# Altium project CAR_V6_Project.PrjPcb
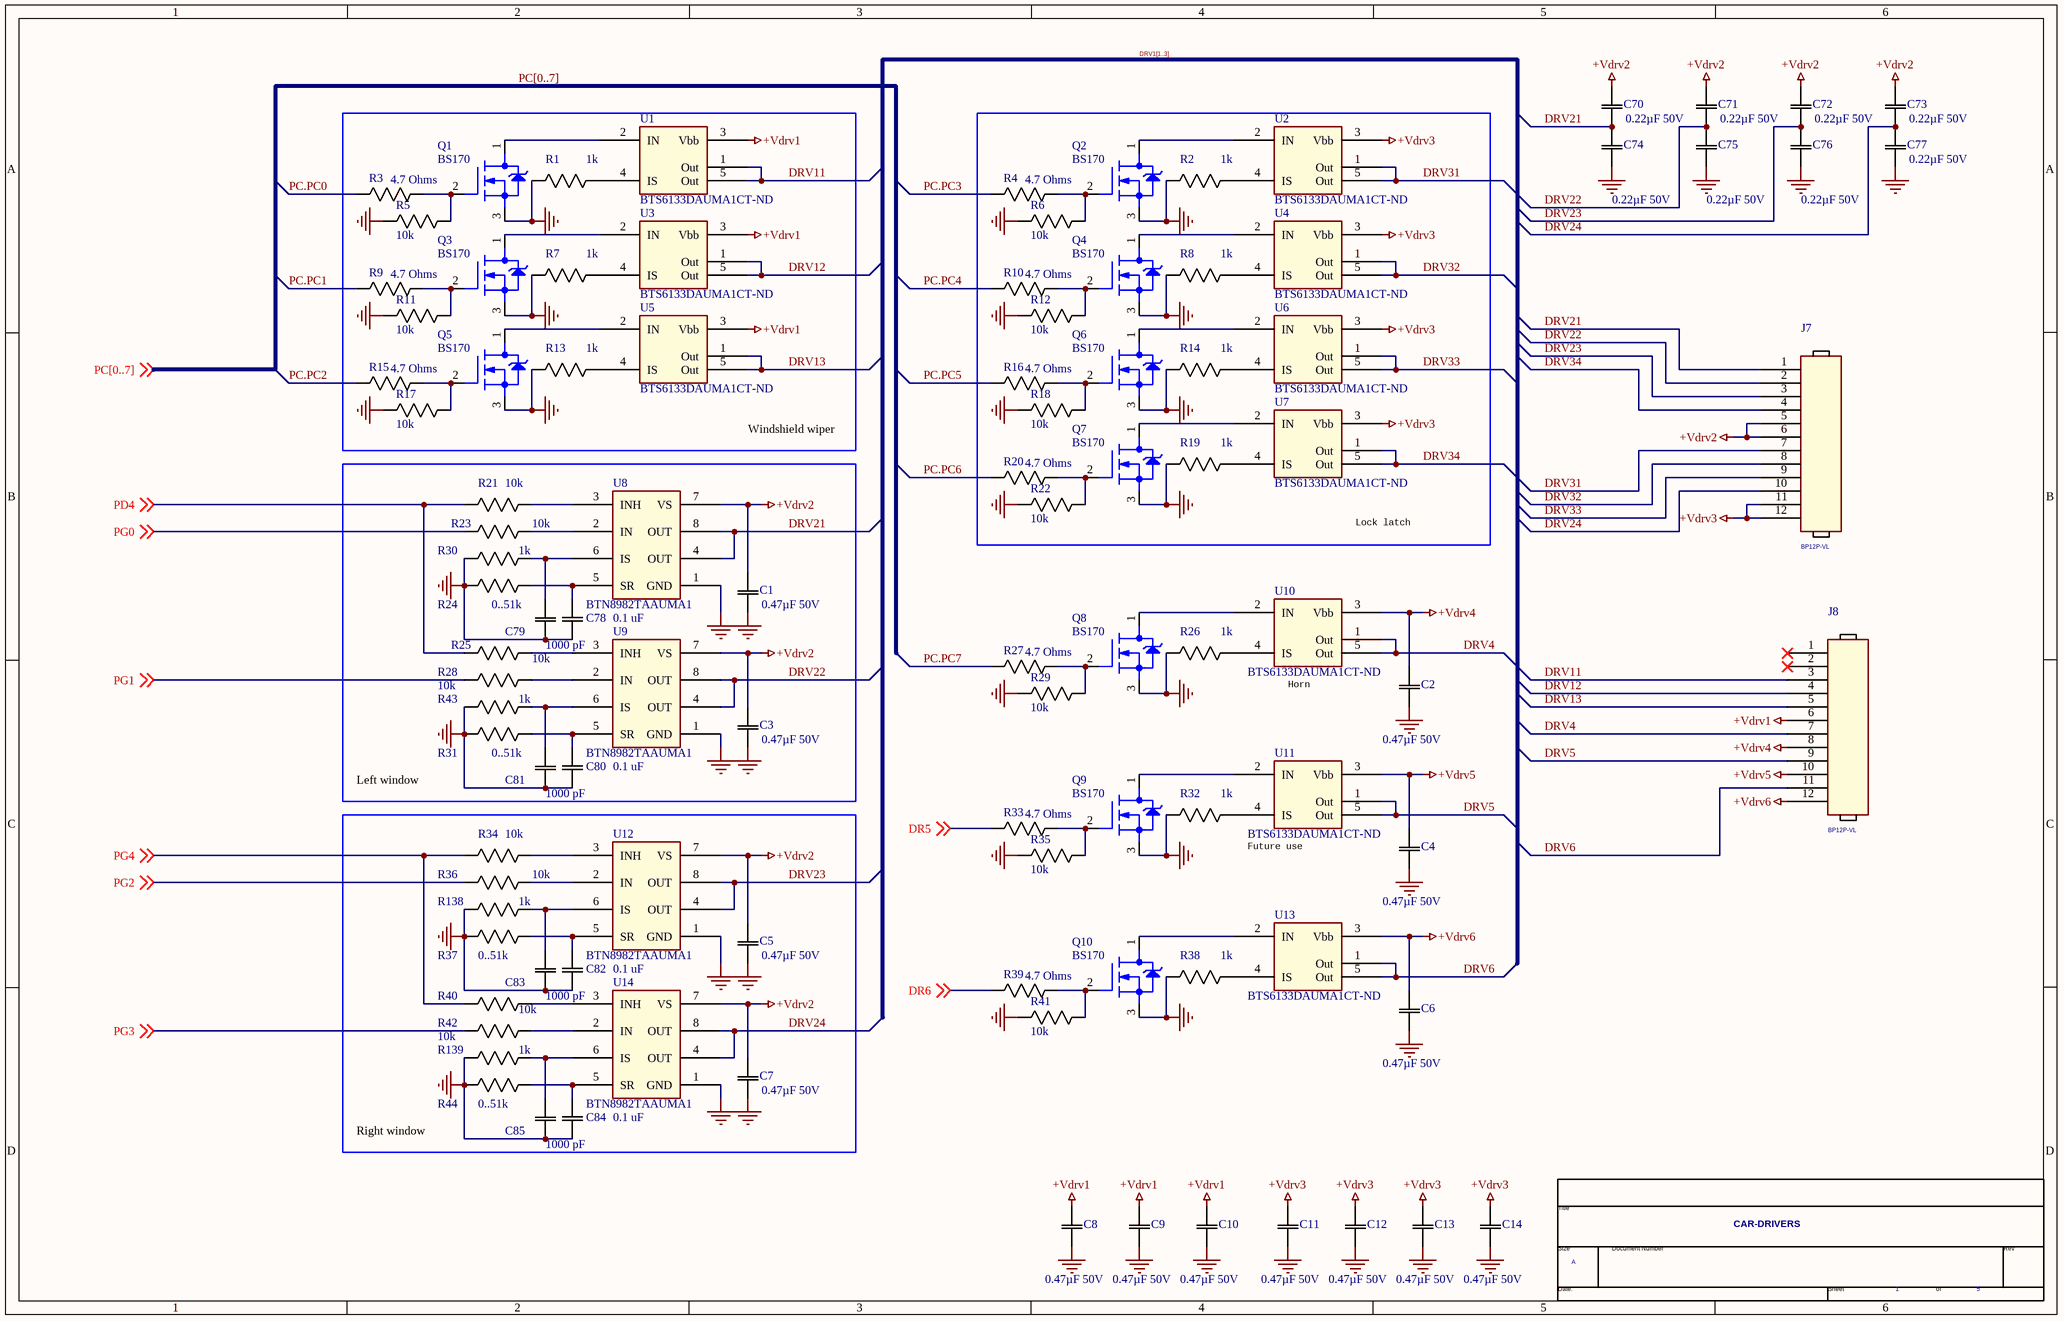
[diagram p0: DRIVERS.SchDoc]
5 sheets, 320 parts. Net scope: global (net labels, ports and power ports of the same name join across sheets).
Board file: CAR.PcbDoc
Sheets:
  DRIVERS.SchDoc
  LIGHT.SchDoc
  MAIN.SchDoc
  POWER.SchDoc
  SENSORS.SchDoc

## Sheet DRIVERS.SchDoc
size 386 x 246 mm

### Parts
(Parts that share a designator on the sheet are numbered #1, #2 ... from top to bottom, then left to right.)
*#1  Page Count: 5  Page Number: 1  Page Size: A  Title: CAR-DRIVERS  (hidden comment: TitleBlock0)  (graphical)
C1  0.47µF 50V  [SR20]
C2  0.47µF 50V  [SR20]
C3  0.47µF 50V  [SR20]
C4  0.47µF 50V  [SR20]
C5  0.47µF 50V  [SR20]
C6  0.47µF 50V  [SR20]
C7  0.47µF 50V  [SR20]
C8  0.47µF 50V  [SR20]
C9  0.47µF 50V  [SR20]
C10  0.47µF 50V  [SR20]
C11  0.47µF 50V  [SR20]
C12  0.47µF 50V  [SR20]
C13  0.47µF 50V  [SR20]
C14  0.47µF 50V  [SR20]
C70  0.22µF 50V  [SR20]
C71  0.22µF 50V  [SR20]
C72  0.22µF 50V  [SR20]
C73  0.22µF 50V  [SR20]
C74  0.22µF 50V  [SR20]
C75  0.22µF 50V  [SR20]
C76  0.22µF 50V  [SR20]
C77  0.22µF 50V  [SR20]
C78  0.1 uF  [SR20]
C79  1000 pF  [SR20]
C80  0.1 uF  [SR20]
C81  1000 pF  [SR20]
C82  0.1 uF  [SR20]
C83  1000 pF  [SR20]
C84  0.1 uF  [SR20]
C85  1000 pF  [SR20]
J7  BP12P-VL  [MOLEX_0874271202]
J8  BP12P-VL  [MOLEX_0874271202]
Q1  BS170  [TO-92]
Q2  BS170  [TO-92]
Q3  BS170  [TO-92]
Q4  BS170  [TO-92]
Q5  BS170  [TO-92]
Q6  BS170  [TO-92]
Q7  BS170  [TO-92]
Q8  BS170  [TO-92]
Q9  BS170  [TO-92]
Q10  BS170  [TO-92]
R1  1k  [RES AXIAL 1/6W]
R2  1k  [RES AXIAL 1/6W]
R3  4.7 Ohms  [RES AXIAL 1/6W]
R4  4.7 Ohms  [RES AXIAL 1/6W]
R5  10k  [RES AXIAL 1/6W]
R6  10k  [RES AXIAL 1/6W]
R7  1k  [RES AXIAL 1/6W]
R8  1k  [RES AXIAL 1/6W]
R9  4.7 Ohms  [RES AXIAL 1/6W]
R10  4.7 Ohms  [RES AXIAL 1/6W]
R11  10k  [RES AXIAL 1/6W]
R12  10k  [RES AXIAL 1/6W]
R13  1k  [RES AXIAL 1/6W]
R14  1k  [RES AXIAL 1/6W]
R15  4.7 Ohms  [RES AXIAL 1/6W]
R16  4.7 Ohms  [RES AXIAL 1/6W]
R17  10k  [RES AXIAL 1/6W]
R18  10k  [RES AXIAL 1/6W]
R19  1k  [RES AXIAL 1/6W]
R20  4.7 Ohms  [RES AXIAL 1/6W]
R21  10k  [RES AXIAL 1/6W]
R22  10k  [RES AXIAL 1/6W]
R23  10k  [RES AXIAL 1/6W]
R24  0..51k  [RES AXIAL 1/6W]
R25  10k  [RES AXIAL 1/6W]
R26  1k  [RES AXIAL 1/6W]
R27  4.7 Ohms  [RES AXIAL 1/6W]
R28  10k  [RES AXIAL 1/6W]
R29  10k  [RES AXIAL 1/6W]
R30  1k  [RES AXIAL 1/6W]
R31  0..51k  [RES AXIAL 1/6W]
R32  1k  [RES AXIAL 1/6W]
R33  4.7 Ohms  [RES AXIAL 1/6W]
R34  10k  [RES AXIAL 1/6W]
R35  10k  [RES AXIAL 1/6W]
R36  10k  [RES AXIAL 1/6W]
R37  0..51k  [RES AXIAL 1/6W]
R38  1k  [RES AXIAL 1/6W]
R39  4.7 Ohms  [RES AXIAL 1/6W]
R40  10k  [RES AXIAL 1/6W]
R41  10k  [RES AXIAL 1/6W]
R42  10k  [RES AXIAL 1/6W]
R43  1k  [RES AXIAL 1/6W]
R44  0..51k  [RES AXIAL 1/6W]
R138  1k  [RES AXIAL 1/6W]
R139  1k  [RES AXIAL 1/6W]
U1  BTS6133DAUMA1CT-ND  [TO114P998X235-6_5N_L]
U2  BTS6133DAUMA1CT-ND  [TO114P998X235-6_5N_L]
U3  BTS6133DAUMA1CT-ND  [TO114P998X235-6_5N_L]
U4  BTS6133DAUMA1CT-ND  [TO114P998X235-6_5N_L]
U5  BTS6133DAUMA1CT-ND  [TO114P998X235-6_5N_L]
U6  BTS6133DAUMA1CT-ND  [TO114P998X235-6_5N_L]
U7  BTS6133DAUMA1CT-ND  [TO114P998X235-6_5N_L]
U8  BTN8982TAAUMA1  [TO263-7]
U9  BTN8982TAAUMA1  [TO263-7]
U10  BTS6133DAUMA1CT-ND  [TO114P998X235-6_5N_L]
U11  BTS6133DAUMA1CT-ND  [TO114P998X235-6_5N_L]
U12  BTN8982TAAUMA1  [TO263-7]
U13  BTS6133DAUMA1CT-ND  [TO114P998X235-6_5N_L]
U14  BTN8982TAAUMA1  [TO263-7]

### Blocks framed on the sheet
Windshield wiper: Q1 Q3 Q5 R1 R3 R5 R7 R9 R11 R13 R15 R17 U1 U3 U5
Lock latch: Q2 Q4 Q6 Q7 R2 R4 R6 R8 R10 R12 R14 R16 R18-R20 R22 U2 U4 U6 U7
Left window: C1 C3 C78-C81 R21 R23-R25 R28 R30 R31 R43 U8 U9
Right window: C5 C7 C82-C85 R34 R36 R37 R40 R42 R44 R138 R139 U12 U14

### Nets
+Vdrv1: C8.2 C9.2 C10.2 J8.6 U1.3(Vbb) U3.3(Vbb) U5.3(Vbb)
+Vdrv2: C1.2 C3.2 C5.2 C7.2 C70.2 C71.2 C72.2 C73.2 J7.5 J7.6 U8.7(VS) U9.7(VS) U12.7(VS) U14.7(VS)
+Vdrv3: C11.2 C12.2 C13.2 C14.2 J7.11 J7.12 U2.3(Vbb) U4.3(Vbb) U6.3(Vbb) U7.3(Vbb)
+Vdrv4: C2.2 J8.8 U10.3(Vbb)
+Vdrv5: C4.2 J8.10 U11.3(Vbb)
+Vdrv6: C6.2 J8.12 U13.3(Vbb)
GND: C1.1 C2.1 C3.1 C4.1 C5.1 C6.1 C7.1 C8.1 C9.1 C10.1 C11.1 C12.1 C13.1 C14.1 C74.1 C75.1 C76.1 C77.1 C78.2 C79.1 C80.2 C81.1 C82.2 C83.1 C84.2 C85.1 Q1.3(S) Q2.3(S) Q3.3(S) Q4.3(S) Q5.3(S) Q6.3(S) Q7.3(S) Q8.3(S) Q9.3(S) Q10.3(S) R1.2 R2.2 R5.1 R6.1 R7.2 R8.2 R11.1 R12.1 R13.2 R14.2 R17.1 R18.1 R19.2 R22.1 R24.1 R26.2 R29.1 R30.2 R31.1 R32.2 R35.1 R37.1 R38.2 R41.1 R43.2 R44.1 R138.2 R139.2 U8.1(GND) U9.1(GND) U12.1(GND) U14.1(GND)
DR5: R33.2 ; off-sheet DR5
DR6: R39.2 ; off-sheet DR6
DRV4: J8.7 U10.1(Out) U10.5(Out)
DRV5: J8.9 U11.1(Out) U11.5(Out)
DRV6: J8.11 U13.1(Out) U13.5(Out)
DRV11: J8.3 U1.1(Out) U1.5(Out)
DRV12: J8.4 U3.1(Out) U3.5(Out)
DRV13: J8.5 U5.1(Out) U5.5(Out)
DRV21: C70.1 C74.2 J7.1 U8.4(OUT) U8.8(OUT)
DRV22: C71.1 C75.2 J7.2 U9.4(OUT) U9.8(OUT)
DRV23: C72.1 C76.2 J7.3 U12.4(OUT) U12.8(OUT)
DRV24: C73.1 C77.2 J7.10 U14.4(OUT) U14.8(OUT)
DRV31: J7.7 U2.1(Out) U2.5(Out)
DRV32: J7.8 U4.1(Out) U4.5(Out)
DRV33: J7.9 U6.1(Out) U6.5(Out)
DRV34: J7.4 U7.1(Out) U7.5(Out)
PC.PC0: R3.2
PC.PC1: R9.2
PC.PC2: R15.2
PC.PC3: R4.2
PC.PC4: R10.2
PC.PC5: R16.2
PC.PC6: R20.2
PC.PC7: R27.2
PD4: R21.1 R25.1 ; off-sheet PD4
PG0: R23.1 ; off-sheet PG0
PG1: R28.1 ; off-sheet PG1
PG2: R36.1 ; off-sheet PG2
PG3: R42.1 ; off-sheet PG3
PG4: R34.1 R40.1 ; off-sheet PG4
NetC78_1: C78.1 R24.2 U8.5(SR)
NetC79_2: C79.2 R30.1 U8.6(IS)
NetC80_1: C80.1 R31.2 U9.5(SR)
NetC81_2: C81.2 R43.1 U9.6(IS)
NetC82_1: C82.1 R37.2 U12.5(SR)
NetC83_2: C83.2 R138.1 U12.6(IS)
NetC84_1: C84.1 R44.2 U14.5(SR)
NetC85_2: C85.2 R139.1 U14.6(IS)
NetQ1_1: Q1.1(D) U1.2(IN)
NetQ1_2: Q1.2(G) R3.1 R5.2
NetQ2_1: Q2.1(D) U2.2(IN)
NetQ2_2: Q2.2(G) R4.1 R6.2
NetQ3_1: Q3.1(D) U3.2(IN)
NetQ3_2: Q3.2(G) R9.1 R11.2
NetQ4_1: Q4.1(D) U4.2(IN)
NetQ4_2: Q4.2(G) R10.1 R12.2
NetQ5_1: Q5.1(D) U5.2(IN)
NetQ5_2: Q5.2(G) R15.1 R17.2
NetQ6_1: Q6.1(D) U6.2(IN)
NetQ6_2: Q6.2(G) R16.1 R18.2
NetQ7_1: Q7.1(D) U7.2(IN)
NetQ7_2: Q7.2(G) R20.1 R22.2
NetQ8_1: Q8.1(D) U10.2(IN)
NetQ8_2: Q8.2(G) R27.1 R29.2
NetQ9_1: Q9.1(D) U11.2(IN)
NetQ9_2: Q9.2(G) R33.1 R35.2
NetQ10_1: Q10.1(D) U13.2(IN)
NetQ10_2: Q10.2(G) R39.1 R41.2
NetR1_1: R1.1 U1.4(IS)
NetR2_1: R2.1 U2.4(IS)
NetR7_1: R7.1 U3.4(IS)
NetR8_1: R8.1 U4.4(IS)
NetR13_1: R13.1 U5.4(IS)
NetR14_1: R14.1 U6.4(IS)
NetR19_1: R19.1 U7.4(IS)
NetR21_2: R21.2 U8.3(INH)
NetR23_2: R23.2 U8.2(IN)
NetR25_2: R25.2 U9.3(INH)
NetR26_1: R26.1 U10.4(IS)
NetR28_2: R28.2 U9.2(IN)
NetR32_1: R32.1 U11.4(IS)
NetR34_2: R34.2 U12.3(INH)
NetR36_2: R36.2 U12.2(IN)
NetR38_1: R38.1 U13.4(IS)
NetR40_2: R40.2 U14.3(INH)
NetR42_2: R42.2 U14.2(IN)

Not connected (* = marked no-connect by the designer): J8 1* 2*

### Buses and harness runs
bus DRV1[1..3]
bus PC[0..7]

### Notes on the sheet
- (near U10) Horn
- Future use
- (in symbol TitleBlock0) Title; Size; Document Number; Rev; Date:; Sheet; of

### Library data of the parts
C1-C14 = CAP RADIAL 2.54: CAP CER 0.47UF 50V X7R RADIAL; Manufacturer_Part_Number: C315C474K5R5TA7303; Vendor: KEMET; Type: DEV; RefDes: RefDes; Value: 0.47µF 50V
C70-C77 = CAP RADIAL 2.54: CAP CER 0.22UF 50V X7R RADIAL; Manufacturer_Part_Number: C320C224K5R5TA; Vendor: KEMET; Type: DEV; RefDes: RefDes; Value: 0.22µF 50V
C78 C80 C82 C84 = CAP RADIAL 2.54: 0.1µF ±10% 100V Ceramic Capacitor X7R Radial; Manufacturer_Part_Number: C320C104K1R5TA7301; Vendor: KEMET; Type: DEV; RefDes: RefDes; Value: 0.1 uF
C79 C81 C83 C85 = CAP RADIAL 2.54: CAP CER 1000PF 50V X7R RADIAL; Manufacturer_Part_Number: C315C102K5R5TA7301; Vendor: KEMET; Type: DEV; RefDes: RefDes; Value: 1000 pF
J7 J8 = HEADER 12
Q1-Q10 = BS170: MOSFET N-CH 60V 500MA TO-92; Manufacturer_Part_Number: ON Semiconductor; Value: BS170
R1 R2 R7 R8 R13 R14 R19 R26 R30 R32 R38 R43 R138 R139 = Resistor Axial  1/6W: RES 1K OHM 1/6W 5% AXIAL; Manufacturer_Part_Number: CFR-12JB-52-1K; Vendor: Yageo; RefDes: RefDes; Type: DEV; Value: 1k
R3 R4 R9 R10 R15 R16 R20 R27 R33 R39 = Resistor Axial  1/6W: RES 4.7 OHM 1/6W 5% AXIAL; Manufacturer_Part_Number: CFR-12JB-52-4R7; Vendor: Yageo; RefDes: RefDes; Type: DEV; Value: 4.7 Ohms
R5 R6 R11 R12 R17 R18 R21-R23 R25 R28 R29 R34-R36 R40-R42 = Resistor Axial  1/6W: RES 10K OHM 1/6W 5% AXIAL; Manufacturer_Part_Number: CFR-12JB-52-10K; Vendor: Yageo; RefDes: RefDes; Type: DEV; Value: 10k
R24 R31 R37 R44 = Resistor Axial  1/6W: RES 1/6W AXIAL; Vendor: Yageo; RefDes: RefDes; Type: DEV; Value: 0..51k
  R31 R44: Manufacturer_Part_Number: *
U8 U9 U12 U14 = BTN7971B
*#1 = TitleBlock0: Page Create Date: March  8, 1995

## Sheet LIGHT.SchDoc
size 246 x 182 mm
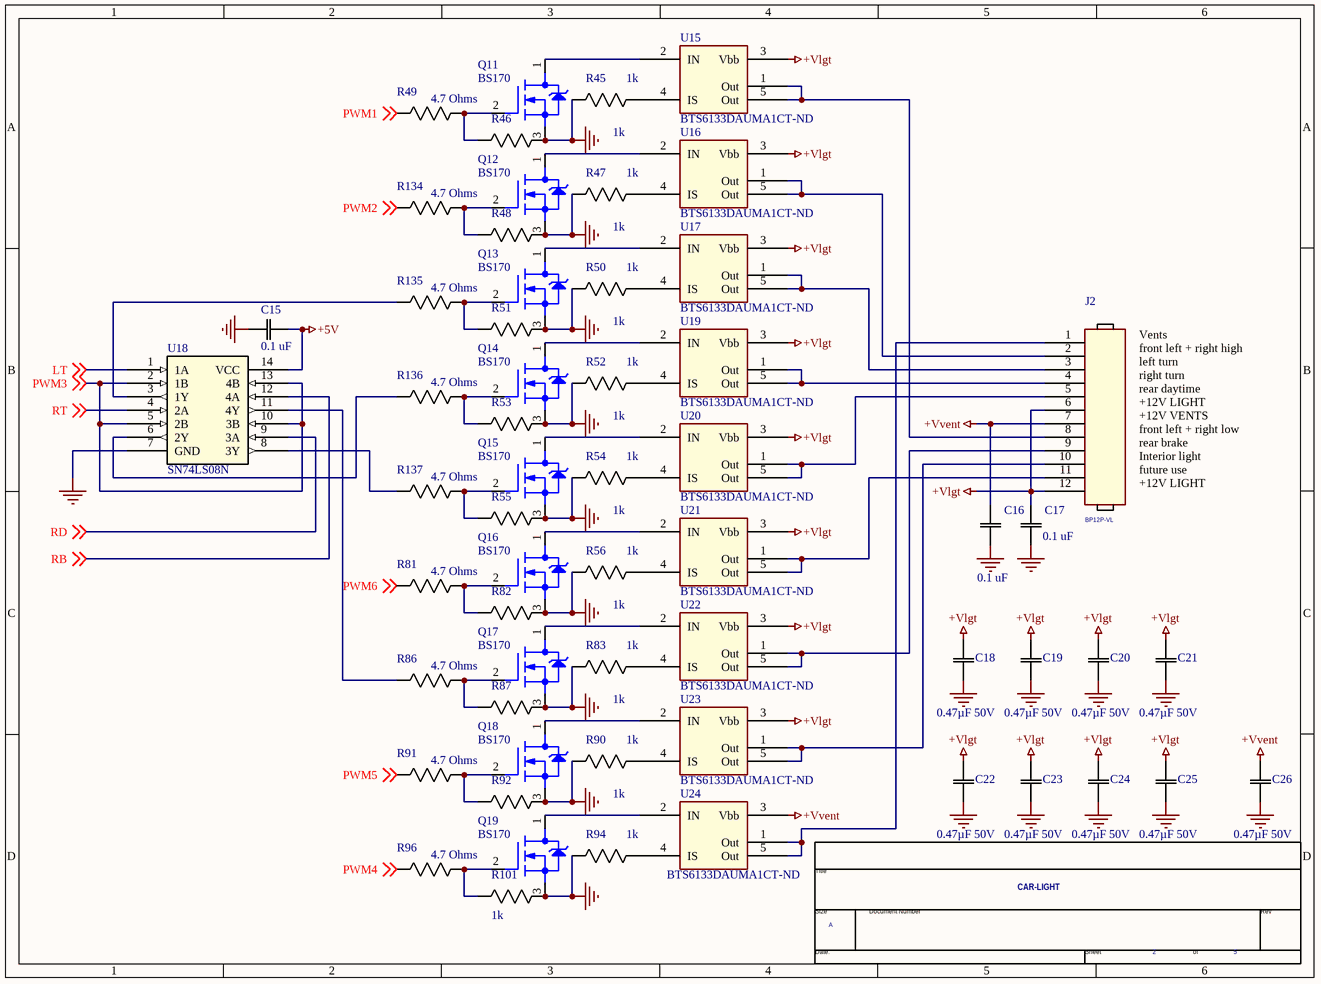
[diagram p1: LIGHT.SchDoc]

### Parts
(Parts that share a designator on the sheet are numbered #1, #2 ... from top to bottom, then left to right.)
*#2  Page Count: 5  Page Number: 2  Page Size: A  Title: CAR-LIGHT  (hidden comment: TitleBlock0)  (graphical)
C15  0.1 uF  [SR20]
C16  0.1 uF  [SR20]
C17  0.1 uF  [SR20]
C18  0.47µF 50V  [SR20]
C19  0.47µF 50V  [SR20]
C20  0.47µF 50V  [SR20]
C21  0.47µF 50V  [SR20]
C22  0.47µF 50V  [SR20]
C23  0.47µF 50V  [SR20]
C24  0.47µF 50V  [SR20]
C25  0.47µF 50V  [SR20]
C26  0.47µF 50V  [SR20]
J2  BP12P-VL  [MOLEX_0874271202]
Q11  BS170  [TO-92]
Q12  BS170  [TO-92]
Q13  BS170  [TO-92]
Q14  BS170  [TO-92]
Q15  BS170  [TO-92]
Q16  BS170  [TO-92]
Q17  BS170  [TO-92]
Q18  BS170  [TO-92]
Q19  BS170  [TO-92]
R45  1k  [RES AXIAL 1/6W]
R46  1k  [RES AXIAL 1/6W]
R47  1k  [RES AXIAL 1/6W]
R48  1k  [RES AXIAL 1/6W]
R49  4.7 Ohms  [RES AXIAL 1/6W]
R50  1k  [RES AXIAL 1/6W]
R51  1k  [RES AXIAL 1/6W]
R52  1k  [RES AXIAL 1/6W]
R53  1k  [RES AXIAL 1/6W]
R54  1k  [RES AXIAL 1/6W]
R55  1k  [RES AXIAL 1/6W]
R56  1k  [RES AXIAL 1/6W]
R81  4.7 Ohms  [RES AXIAL 1/6W]
R82  1k  [RES AXIAL 1/6W]
R83  1k  [RES AXIAL 1/6W]
R86  4.7 Ohms  [RES AXIAL 1/6W]
R87  1k  [RES AXIAL 1/6W]
R90  1k  [RES AXIAL 1/6W]
R91  4.7 Ohms  [RES AXIAL 1/6W]
R92  1k  [RES AXIAL 1/6W]
R94  1k  [RES AXIAL 1/6W]
R96  4.7 Ohms  [RES AXIAL 1/6W]
R101  1k  [RES AXIAL 1/6W]
R134  4.7 Ohms  [RES AXIAL 1/6W]
R135  4.7 Ohms  [RES AXIAL 1/6W]
R136  4.7 Ohms  [RES AXIAL 1/6W]
R137  4.7 Ohms  [RES AXIAL 1/6W]
U15  BTS6133DAUMA1CT-ND  [TO114P998X235-6_5N_L]
U16  BTS6133DAUMA1CT-ND  [TO114P998X235-6_5N_L]
U17  BTS6133DAUMA1CT-ND  [TO114P998X235-6_5N_L]
U18  SN74LS08N  [PDIP14_300MC]
U19  BTS6133DAUMA1CT-ND  [TO114P998X235-6_5N_L]
U20  BTS6133DAUMA1CT-ND  [TO114P998X235-6_5N_L]
U21  BTS6133DAUMA1CT-ND  [TO114P998X235-6_5N_L]
U22  BTS6133DAUMA1CT-ND  [TO114P998X235-6_5N_L]
U23  BTS6133DAUMA1CT-ND  [TO114P998X235-6_5N_L]
U24  BTS6133DAUMA1CT-ND  [TO114P998X235-6_5N_L]

### Nets
+5V: C15.1 U18.14(VCC)
+Vlgt: C17.2 C18.2 C19.2 C20.2 C21.2 C22.2 C23.2 C24.2 C25.2 J2.6 J2.12 U15.3(Vbb) U16.3(Vbb) U17.3(Vbb) U19.3(Vbb) U20.3(Vbb) U21.3(Vbb) U22.3(Vbb) U23.3(Vbb)
+Vvent: C16.2 C26.2 J2.7 U24.3(Vbb)
GND: C15.2 C16.1 C17.1 C18.1 C19.1 C20.1 C21.1 C22.1 C23.1 C24.1 C25.1 C26.1 Q11.3(S) Q12.3(S) Q13.3(S) Q14.3(S) Q15.3(S) Q16.3(S) Q17.3(S) Q18.3(S) Q19.3(S) R45.2 R46.1 R47.2 R48.1 R50.2 R51.1 R52.2 R53.1 R54.2 R55.1 R56.2 R82.1 R83.2 R87.1 R90.2 R92.1 R94.2 R101.1 U18.7(GND)
LT: U18.1(1A) ; off-sheet LT
PWM1: R49.2 ; off-sheet PWM1
PWM2: R134.2 ; off-sheet PWM2
PWM3: U18.2(1B) U18.5(2B) U18.10(3B) U18.13(4B) ; off-sheet PWM3
PWM4: R96.2 ; off-sheet PWM4
PWM5: R91.2 ; off-sheet PWM5
PWM6: R81.2 ; off-sheet PWM6
RB: U18.12(4A) ; off-sheet RB
RD: U18.9(3A) ; off-sheet RD
RT: U18.4(2A) ; off-sheet RT
NetJ2_1: J2.1 U24.1(Out) U24.5(Out)
NetJ2_2: J2.2 U16.1(Out) U16.5(Out)
NetJ2_3: J2.3 U17.1(Out) U17.5(Out)
NetJ2_4: J2.4 U19.1(Out) U19.5(Out)
NetJ2_5: J2.5 U20.1(Out) U20.5(Out)
NetJ2_8: J2.8 U15.1(Out) U15.5(Out)
NetJ2_9: J2.9 U22.1(Out) U22.5(Out)
NetJ2_10: J2.10 U23.1(Out) U23.5(Out)
NetJ2_11: J2.11 U21.1(Out) U21.5(Out)
NetQ11_1: Q11.1(D) U15.2(IN)
NetQ11_2: Q11.2(G) R46.2 R49.1
NetQ12_1: Q12.1(D) U16.2(IN)
NetQ12_2: Q12.2(G) R48.2 R134.1
NetQ13_1: Q13.1(D) U17.2(IN)
NetQ13_2: Q13.2(G) R51.2 R135.1
NetQ14_1: Q14.1(D) U19.2(IN)
NetQ14_2: Q14.2(G) R53.2 R136.1
NetQ15_1: Q15.1(D) U20.2(IN)
NetQ15_2: Q15.2(G) R55.2 R137.1
NetQ16_1: Q16.1(D) U21.2(IN)
NetQ16_2: Q16.2(G) R81.1 R82.2
NetQ17_1: Q17.1(D) U22.2(IN)
NetQ17_2: Q17.2(G) R86.1 R87.2
NetQ18_1: Q18.1(D) U23.2(IN)
NetQ18_2: Q18.2(G) R91.1 R92.2
NetQ19_1: Q19.1(D) U24.2(IN)
NetQ19_2: Q19.2(G) R96.1 R101.2
NetR45_1: R45.1 U15.4(IS)
NetR47_1: R47.1 U16.4(IS)
NetR50_1: R50.1 U17.4(IS)
NetR52_1: R52.1 U19.4(IS)
NetR54_1: R54.1 U20.4(IS)
NetR56_1: R56.1 U21.4(IS)
NetR83_1: R83.1 U22.4(IS)
NetR86_2: R86.2 U18.11(4Y)
NetR90_1: R90.1 U23.4(IS)
NetR94_1: R94.1 U24.4(IS)
NetR135_2: R135.2 U18.3(1Y)
NetR136_2: R136.2 U18.6(2Y)
NetR137_2: R137.2 U18.8(3Y)

### Notes on the sheet
- front left + right high
- left turn
- right turn
- rear daytime
- Vents
- front left + right low
- rear brake
- Interior light
- +12V VENTS
- +12V LIGHT
- future use
- (in symbol TitleBlock0) Title; Size; Document Number; Rev; Date:; Sheet; of

### Library data of the parts
C15-C17 = CAP RADIAL 2.54: as C78 on sheet DRIVERS; RefDes: RefDes; Value: 0.1 uF
C18-C26 = CAP RADIAL 2.54: as C1 on sheet DRIVERS; RefDes: RefDes; Value: 0.47µF 50V
J2 = HEADER 12
Q11-Q19 = BS170: as Q1 on sheet DRIVERS; Value: BS170
R45-R48 R50-R56 R82 R83 R87 R90 R92 R94 R101 = Resistor Axial  1/6W: as R1 on sheet DRIVERS; RefDes: RefDes; Type: DEV; Value: 1k
R49 R81 R86 R91 R96 R134-R137 = Resistor Axial  1/6W: as R3 on sheet DRIVERS; RefDes: RefDes; Type: DEV; Value: 4.7 Ohms
U18 = SN74LS08N: IC GATE AND 4CH 2-INP 14DIP; Vendor: Texas Instruments; Built_By: EMA_UL_Team; C: Copyright (C) 2015 Accelerated Designs. All rights reserved; Manufacturer_Part_Number: SN74LS08N; RefDes: RefDes; Type: DEV; Value: SN74LS08N
*#2 = TitleBlock0: Page Create Date: March  8, 1995

## Sheet MAIN.SchDoc
size 386 x 246 mm
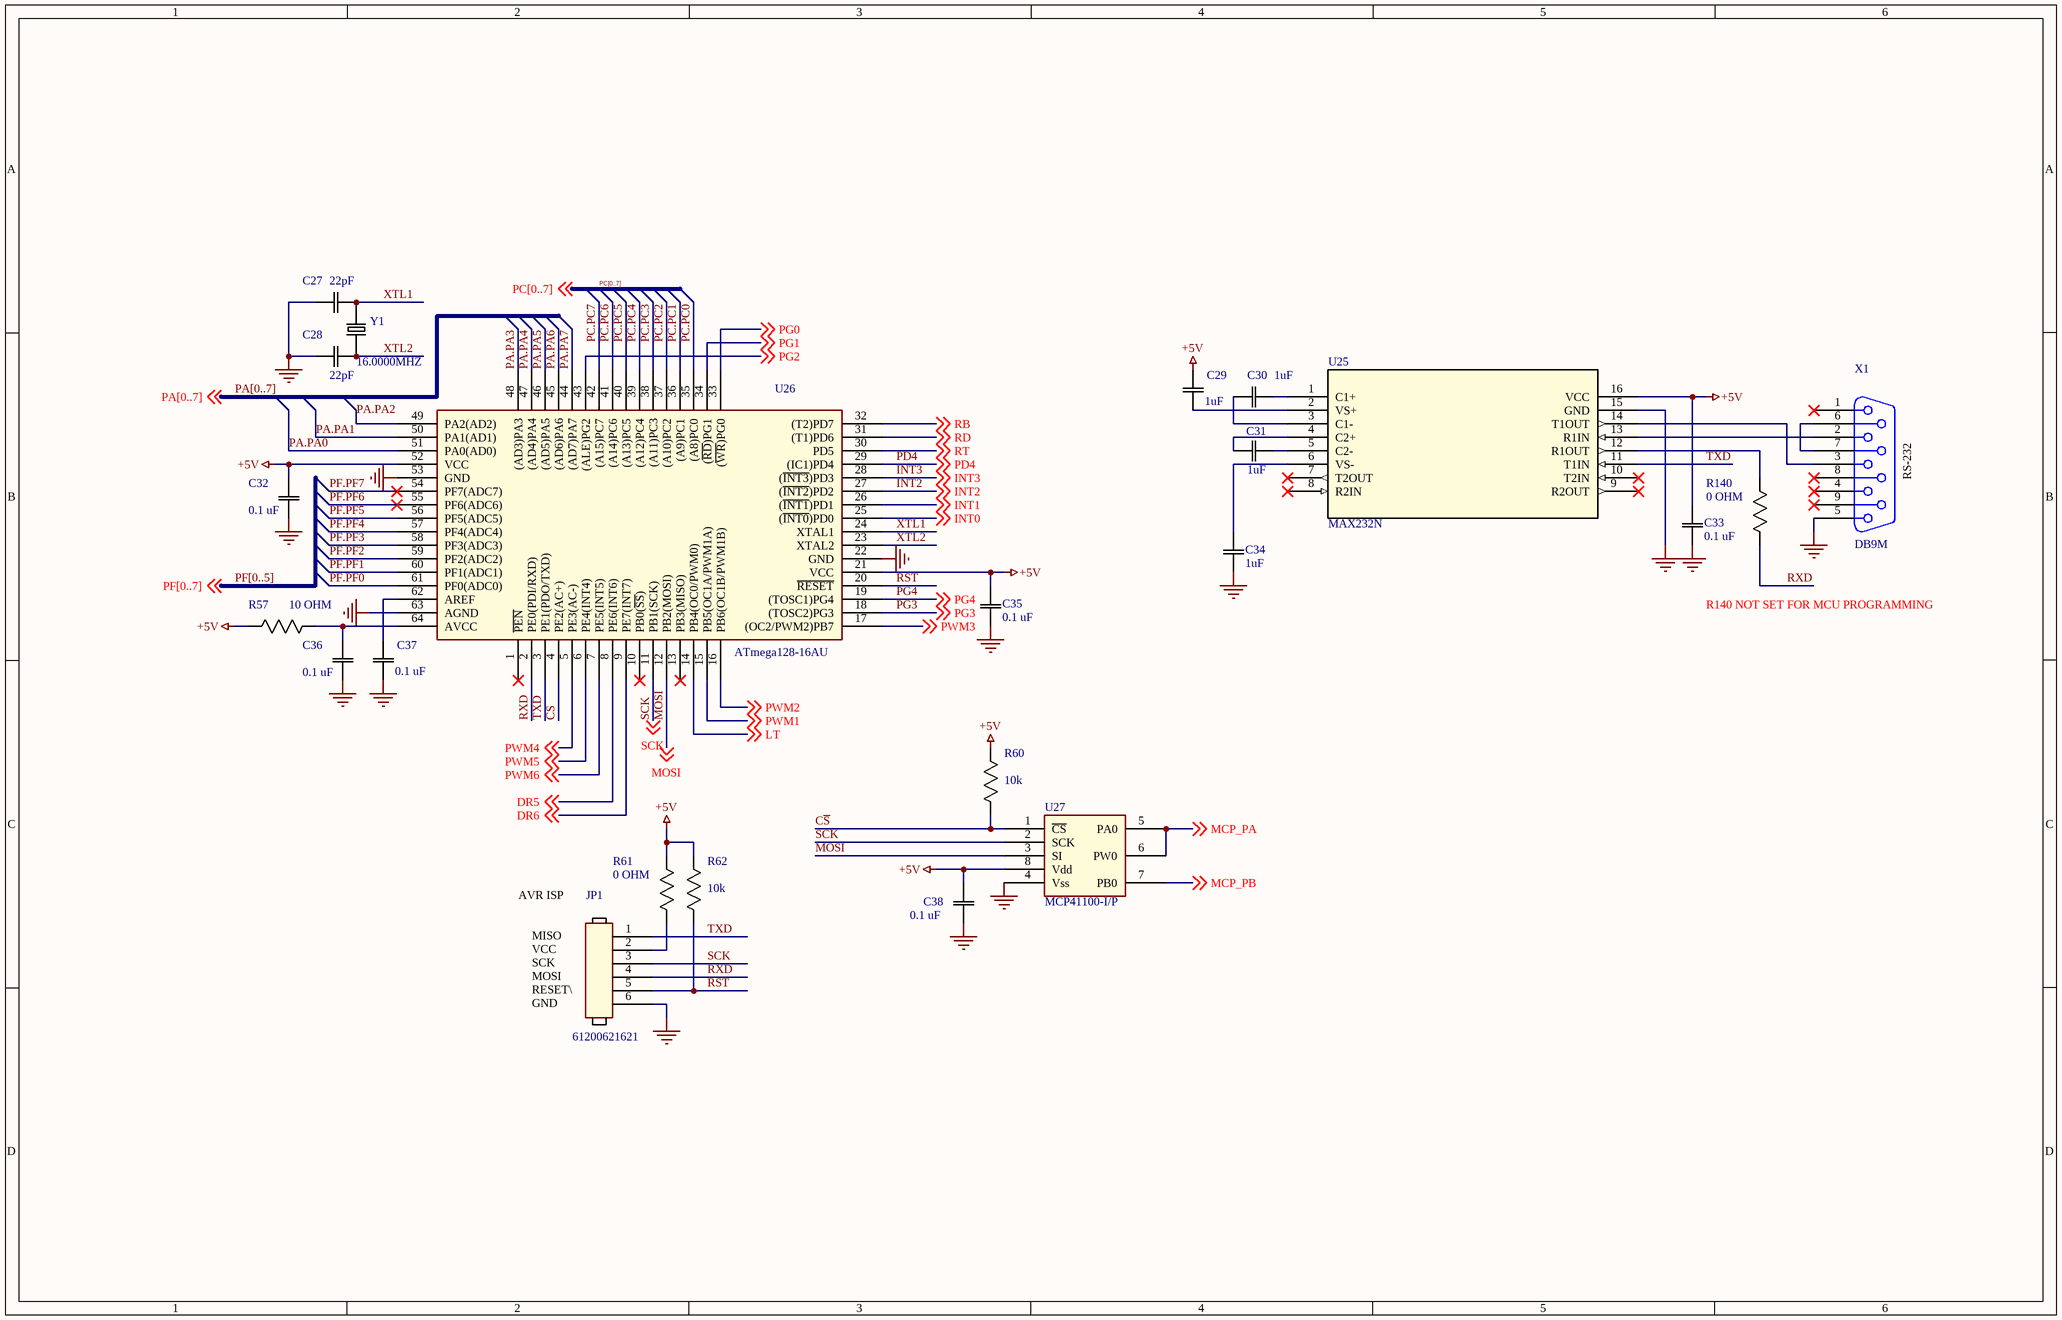
[diagram p2: MAIN.SchDoc]

### Parts
C27  22pF  [SR20]
C28  22pF  [SR20]
C29  1uF  [SR20]
C30  1uF  [SR20]
C31  1uF  [SR20]
C32  0.1 uF  [SR20]
C33  0.1 uF  [SR20]
C34  1uF  [SR20]
C35  0.1 uF  [SR20]
C36  0.1 uF  [SR20]
C37  0.1 uF  [SR20]
C38  0.1 uF  [SR20]
JP1  61200621621  [BLKCON.100/VH/TM2OE/W.200/6]
R57  10 OHM  [RES AXIAL 1/6W]
R60  10k  [RES AXIAL 1/6W]
R61  0 OHM  [RES AXIAL 1/6W]
R62  10k  [RES AXIAL 1/6W]
R140  0 OHM  [RES AXIAL 1/6W]
U25  MAX232N  [N16]
U26  ATmega128-16AU  [QUAD.80M/64/WG16.00]
U27  MCP41100-I/P  [*DIP254P762X508-8]
X1  DB9M  [DSUB/RP.318/TM/9]
Y1  16.0000MHZ  [HC-49/US]

### Nets
+5V: C29.1 C32.2 C33.2 C35.2 C38.2 R57.2 R60.2 R61.2 R62.2 U25.16(VCC) U26.21(VCC) U26.52(VCC) U27.8(Vdd)
GND: C27.1 C28.1 C32.1 C33.1 C34.2 C35.1 C36.1 C37.1 C38.1 JP1.6 U25.15(GND) U26.22(GND) U26.53(GND) U26.63(AGND) U27.4(Vss) X1.5
C~{S}: R60.1 U26.4(PE2(AC+)) U27.1(~{CS})
DR5: U26.8(PE6(INT6)) ; off-sheet DR5
DR6: U26.9(PE7(INT7)) ; off-sheet DR6
INT0: U26.25((~{INT0})PD0) ; off-sheet INT0
INT1: U26.26((~{INT1})PD1) ; off-sheet INT1
INT2: U26.27((~{INT2})PD2) ; off-sheet INT2
INT3: U26.28((~{INT3})PD3) ; off-sheet INT3
LT: U26.14(PB4(OC0/PWM0)) ; off-sheet LT
MCP_PA: U27.5(PA0) U27.6(PW0) ; off-sheet MCP_PA
MCP_PB: U27.7(PB0) ; off-sheet MCP_PB
MOSI: U26.12(PB2(MOSI)) U27.3(SI) ; off-sheet MOSI
PA.PA0: U26.51(PA0(AD0))
PA.PA1: U26.50(PA1(AD1))
PA.PA2: U26.49(PA2(AD2))
PA.PA3: U26.48((AD3)PA3)
PA.PA4: U26.47((AD4)PA4)
PA.PA5: U26.46((AD5)PA5)
PA.PA6: U26.45((AD6)PA6)
PA.PA7: U26.44((AD7)PA7)
PC.PC0: U26.35((A8)PC0)
PC.PC1: U26.36((A9)PC1)
PC.PC2: U26.37((A10)PC2)
PC.PC3: U26.38((A11)PC3)
PC.PC4: U26.39((A12)PC4)
PC.PC5: U26.40((A13)PC5)
PC.PC6: U26.41((A14)PC6)
PC.PC7: U26.42((A15)PC7)
PD4: U26.29((IC1)PD4) ; off-sheet PD4
PF.PF0: U26.61(PF0(ADC0))
PF.PF1: U26.60(PF1(ADC1))
PF.PF2: U26.59(PF2(ADC2))
PF.PF3: U26.58(PF3(ADC3))
PF.PF4: U26.57(PF4(ADC4))
PF.PF5: U26.56(PF5(ADC5))
PF.PF6: U26.55(PF6(ADC6))
PF.PF7: U26.54(PF7(ADC7))
PG0: U26.33((~{WR})PG0) ; off-sheet PG0
PG1: U26.34((~{RD})PG1) ; off-sheet PG1
PG2: U26.43((ALE)PG2) ; off-sheet PG2
PG3: U26.18((TOSC2)PG3) ; off-sheet PG3
PG4: U26.19((TOSC1)PG4) ; off-sheet PG4
PWM1: U26.15(PB5(OC1A/PWM1A)) ; off-sheet PWM1
PWM2: U26.16(PB6(OC1B/PWM1B)) ; off-sheet PWM2
PWM3: U26.17((OC2/PWM2)PB7) ; off-sheet PWM3
PWM4: U26.5(PE3(AC-)) ; off-sheet PWM4
PWM5: U26.6(PE4(INT4)) ; off-sheet PWM5
PWM6: U26.7(PE5(INT5)) ; off-sheet PWM6
RB: U26.32((T2)PD7) ; off-sheet RB
RD: U26.31((T1)PD6) ; off-sheet RD
RS~{T}: JP1.5 R62.1 U26.20(~{RESET})
RT: U26.30(PD5) ; off-sheet RT
RXD: JP1.4 R140.1 U26.2(PE0(PDI/RXD))
SCK: JP1.3 U26.11(PB1(SCK)) U27.2(SCK) ; off-sheet SCK
TXD: JP1.1 U25.11(T1IN) U26.3(PE1(PDO/TXD))
XTL1: C27.2 U26.24(XTAL1) Y1.1
XTL2: C28.2 U26.23(XTAL2) Y1.2
NetC29_2: C29.2 U25.2(VS+)
NetC30_1: C30.1 U25.1(C1+)
NetC30_2: C30.2 U25.3(C1-)
NetC31_1: C31.1 U25.5(C2-)
NetC31_2: C31.2 U25.4(C2+)
NetC34_1: C34.1 U25.6(VS-)
NetC36_2: C36.2 R57.1 U26.64(AVCC)
NetC37_2: C37.2 U26.62(AREF)
NetJP1_2: JP1.2 R61.1
NetR140_2: R140.2 U25.12(R1OUT)
NetU25_13: U25.13(R1IN) X1.2
NetU25_14: U25.14(T1OUT) X1.3
NetX1_6: X1.6 X1.7

Not connected (* = marked no-connect by the designer): U25 7(T2OUT)* 8(R2IN)* 9(R2OUT)* 10(T2IN)*; U26 1(~{PEN})* 10(PB0(~{SS}))* 13(PB3(MISO))*; X1 1* 4* 8* 9*

### Buses and harness runs
bus PA[0..7]
bus PC[0..7]
bus PF[0..5]

### Notes on the sheet
- (near X1) RS-232
- R140 NOT SET FOR MCU PROGRAMMING
- AVR ISP
- MISO
- VCC
- SCK
- MOSI
- (near JP1) RESET\
- GND

### Library data of the parts
C27 C28 = CAP RADIAL 2.54: 22pF ±5% 50V Ceramic Capacitor C0G, NP0 Radial; Manufacturer_Part_Number: C315C220J5G5TA; Vendor: KEMET; Type: DEV; RefDes: RefDes; Value: 22pF
C29-C31 C34 = CAP RADIAL 2.54: 1µF ±10% 25V Ceramic Capacitor X7R Radial; Manufacturer_Part_Number: C315C105K3R5TA; Vendor: KEMET; Type: DEV; RefDes: RefDes; Value: 1uF
C32 C33 C35-C38 = CAP RADIAL 2.54: as C78 on sheet DRIVERS; RefDes: RefDes; Value: 0.1 uF
JP1 = HEADER 6: Wire-To-Board Connector, WR-BHD Series, Through Hole, Header, 6, 2.54 mm, Gold Plated Contacts
R57 = Resistor Axial  1/6W: RES 10 OHM 1/6W 5% AXIAL; Manufacturer_Part_Number: CFR-12JB-52-10R; Vendor: Yageo; RefDes: RefDes; Type: DEV; Value: 10 OHM
R60 R62 = Resistor Axial  1/6W: as R5 on sheet DRIVERS; RefDes: RefDes; Type: DEV; Value: 10k
R61 R140 = Resistor Axial  1/6W: RES 0 OHM 1/6W JUMP AXIAL; Manufacturer_Part_Number: ZOR-12-B-52-0R; Vendor: Yageo; RefDes: RefDes; Type: DEV; Value: 0 OHM
U25 = MAX232N: Imported; Vendor: Texas Instruments; Built_By: EMA_UL_Team; C: Copyright (C) 2015 Accelerated Designs. All rights reserved; Manufacturer_Part_Number: MAX232N; RefDes: RefDes; Type: DEV; Value: Value
U26 = ATMega103_1
U27 = MCP41100-I/P: IC POT DGTL 100K 2CH SPI 14-DIP
X1 = CONNECTOR DB9
Y1 = CRYSTAL HC-49/US: 16MHz ±30ppm Crystal 20pF 40 Ohms HC-49/US; Manufacturer_Part_Number: ECS-160-20-4X; Value: 16.0000MHZ

## Sheet POWER.SchDoc
size 246 x 182 mm
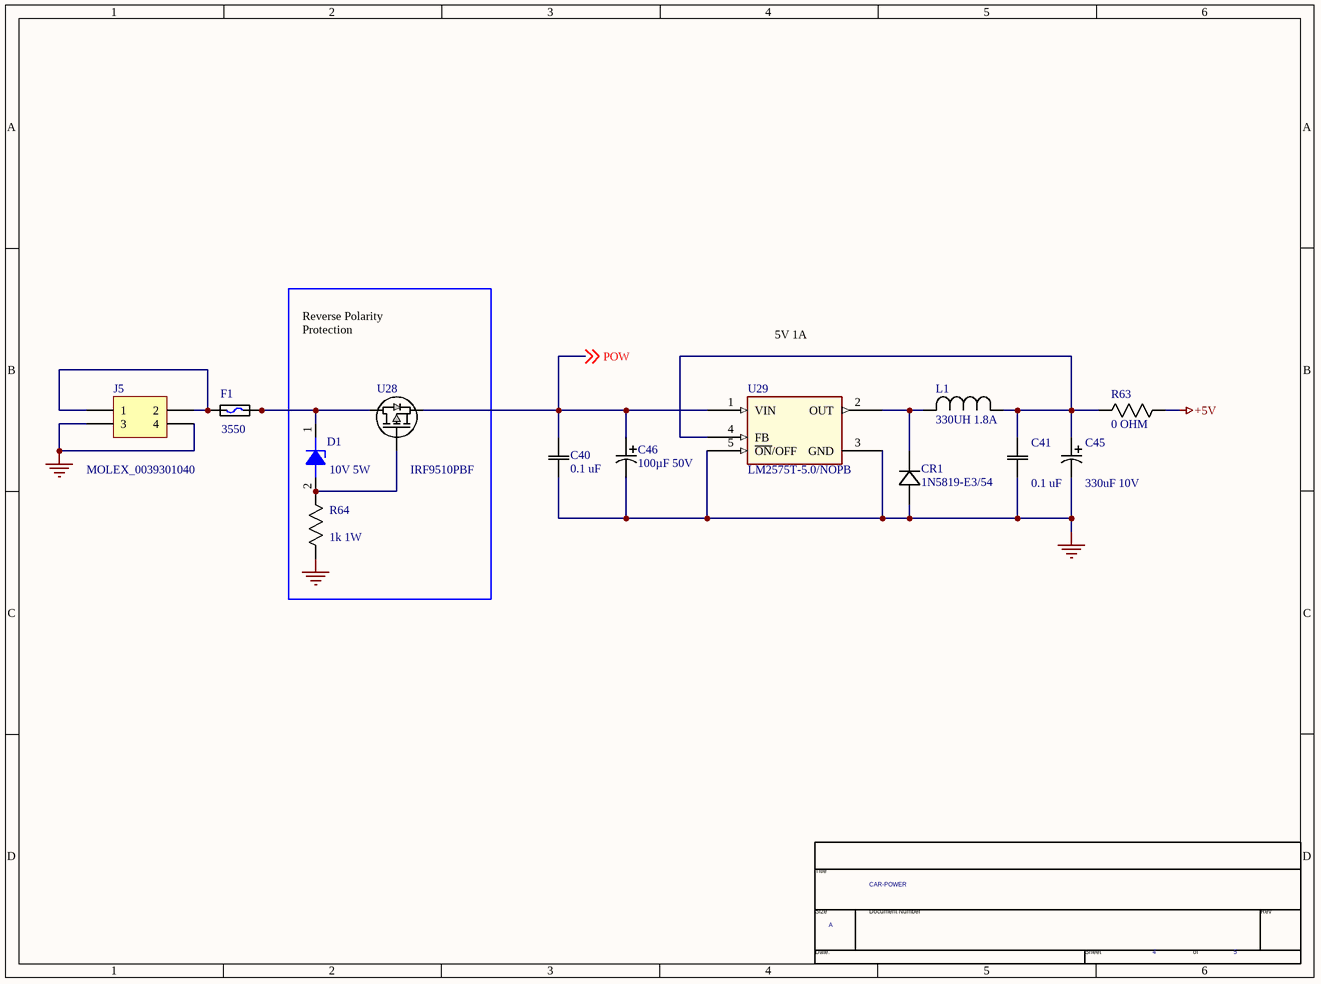
[diagram p3: POWER.SchDoc]

### Parts
(Parts that share a designator on the sheet are numbered #1, #2 ... from top to bottom, then left to right.)
*#3  Page Count: 5  Page Number: 4  Page Size: A  Title: CAR-POWER  (hidden comment: TitleBlock0)  (graphical)
C40  0.1 uF  [SR20]
C41  0.1 uF  [SR20]
C45  330uF 10V  [PCAP_63x112]
C46  100µF 50V  [PCAP_8x112]
CR1  1N5819-E3/54  [DO-204AL]
D1  10V 5W  [CASE_17AA-01]
F1  3550  [FUSE_CLIP_BLADE_HORIZONTAL]
J5  MOLEX_0039301040  [MOLEX_0039301040]
L1  330UH 1.8A  [AIUR-15]
R63  0 OHM  [RES AXIAL 1/6W]
R64  1k 1W  [YAG_FMP100]
U28  IRF9510PBF  [TO220HS]
U29  LM2575T-5.0/NOPB  [TO-220-5HS]

### Nets
+5V: R63.1
GND: C40.1 C41.1 C45.2 C46.2 CR1.2 J5.3 J5.4 R64.1 U29.3(GND) U29.5(~{ON}/OFF)
POW: C40.2 C46.1 U28.3(S) U29.1(VIN) ; off-sheet POW
NetC41_2: C41.2 C45.1 L1.1 R63.2 U29.4(FB)
NetCR1_1: CR1.1 L1.2 U29.2(OUT)
NetD1_1: D1.1(CATHODE) F1.2A F1.2B U28.2(D)
NetD1_2: D1.2(ANODE) R64.2 U28.1(G)
NetF1_1A: F1.1A F1.1B J5.1 J5.2

### Notes on the sheet
- Reverse Polarity
  Protection
- 5V 1A
- (in symbol TitleBlock0) Title; Size; Document Number; Rev; Date:; Sheet; of

### Library data of the parts
C40 C41 = CAP RADIAL 2.54: as C78 on sheet DRIVERS; RefDes: RefDes; Value: 0.1 uF
C45 = PCAP_63x112: CAP ALUM 330UF 20% 10V RADIAL; Manufacturer_Part_Number: ECA-1AM331; Vendor: Panasonic Electronic Components; Value: 330uF 10V
C46 = PCAP_8x112: CAP ALUM 100UF 20% 50V RADIAL; Manufacturer_Part_Number: ECA-1HM101; Vendor: Panasonic Electronic Components; Value: 100µF 50V
CR1 = 1N5819-E3/54: DIODE SCHOTTKY 40V 1A DO204AL; Vendor: Vishay; Built_By: EMA_UL_Team; Type: DEV; C: Copyright (C) 2015 Accelerated Designs. All rights reserved; Manufacturer_Part_Number: 1N5819-E3/54; RefDes: RefDes; Value: Value
D1 = 1N5347BRLG: DIODE ZENER 10V 5W AXIAL; Manufacturer_Part_Number: 1N5347BRLG; Value: 10V 5W
F1 = FUSE_CLIP_BLADE_HORIZONTAL: FUSE CLIP BLADE 500V 30A PCB; MF: Keystone Electronics; MP: 3550; Value: 3550
J5 = Header 2X2: Header, 2-Pin, Dual row; LatestRevisionDate: 17-Jul-2002; LatestRevisionNote: Re-released for DXP Platform.; Publisher: Altium Limited
L1 = AIUR-15-331K: FIXED IND 330UH 1.8A 260 MOHM TH; Manufacturer_Part_Number: AIUR-15-331K-ND; Vendor: Abracon; Built_By: EMA_UL_Team; Type: DEV; C: Copyright (C) 2015 Accelerated Designs. All rights reserved; RefDes: RefDes; Value: 330UH 1.8A
R63 = Resistor Axial  1/6W: as R61 on sheet MAIN; RefDes: RefDes; Type: DEV; Value: 0 OHM
R64 = Resistor Axial  1W: RES 1K OHM 1W 5% AXIAL; Manufacturer_Part_Number: FMP100JR-52-1K; Vendor: Yageo; RefDes: RefDes; Type: DEV; Value: 1k 1W
U28 = IRF9510PBF: Imported; Vendor: Vishay; Built_By: EMA_UL_Team; C: Copyright (C) 2015 Accelerated Designs. All rights reserved; Manufacturer_Part_Number: IRF9510PBF; RefDes: RefDes; Type: DEV; Value: Value
U29 = LM2575T-5.0/NOPB: IC REG BUCK 5V 1A TO220-5; Manufacturer_Part_Number: LM2575T-5.0/NOPB
*#3 = TitleBlock0: Page Create Date: March  8, 1995

## Sheet SENSORS.SchDoc
size 386 x 246 mm
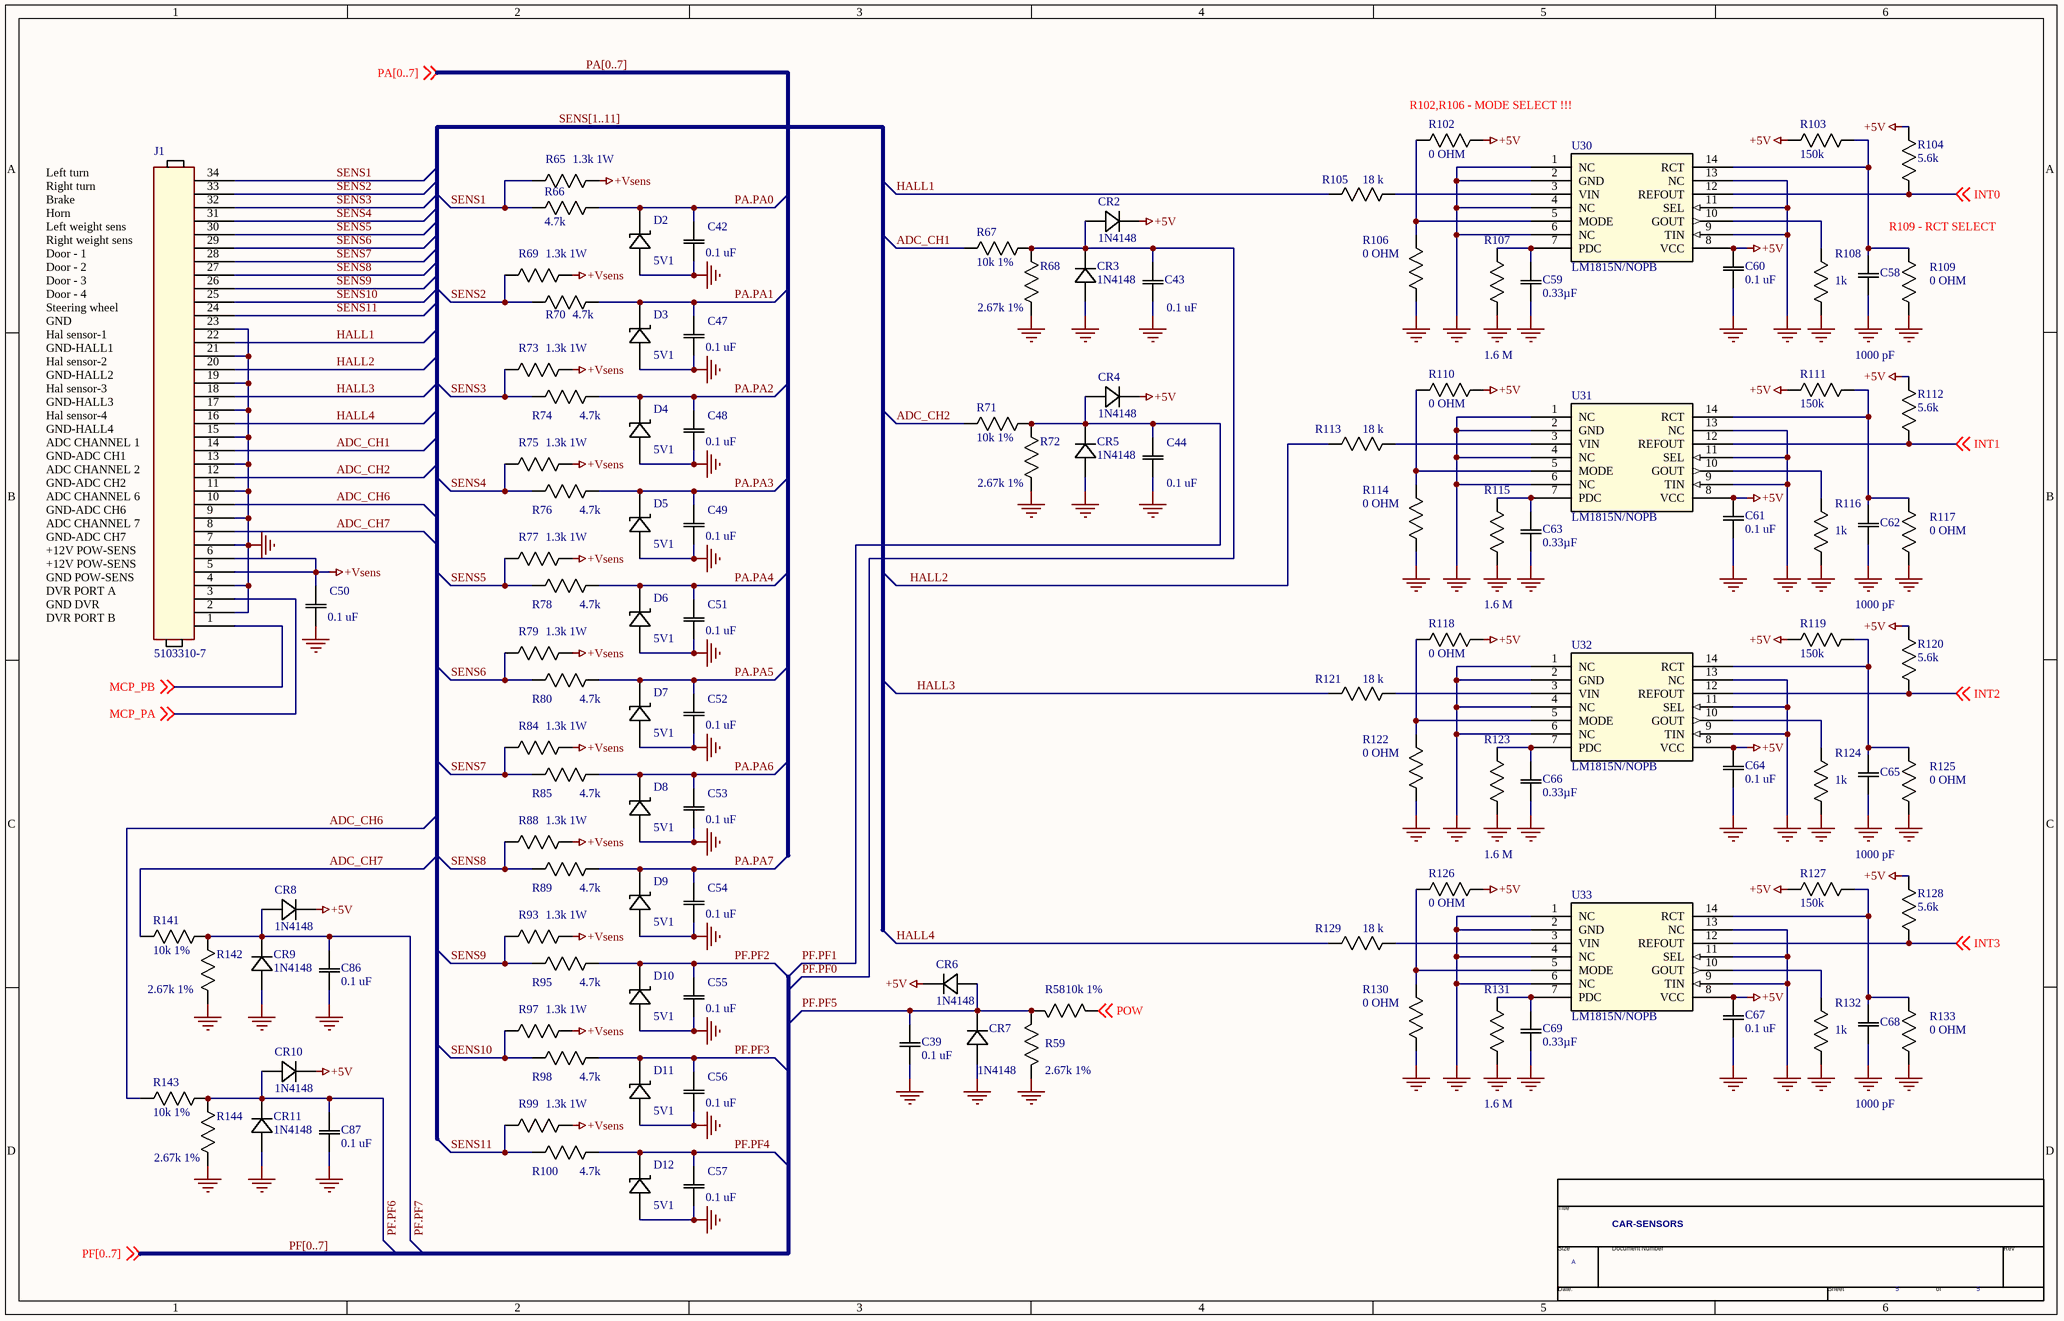
[diagram p4: SENSORS.SchDoc]

### Parts
(Parts that share a designator on the sheet are numbered #1, #2 ... from top to bottom, then left to right.)
*#4  Page Count: 5  Page Size: A  Title: CAR-SENSORS  (hidden comment: TitleBlock0)  (graphical)
C39  0.1 uF  [SR20]
C42  0.1 uF  [SR20]
C43  0.1 uF  [SR20]
C44  0.1 uF  [SR20]
C47  0.1 uF  [SR20]
C48  0.1 uF  [SR20]
C49  0.1 uF  [SR20]
C50  0.1 uF  [SR20]
C51  0.1 uF  [SR20]
C52  0.1 uF  [SR20]
C53  0.1 uF  [SR20]
C54  0.1 uF  [SR20]
C55  0.1 uF  [SR20]
C56  0.1 uF  [SR20]
C57  0.1 uF  [SR20]
C58  1000 pF  [SR20]
C59  0.33µF  [SR20]
C60  0.1 uF  [SR20]
C61  0.1 uF  [SR20]
C62  1000 pF  [SR20]
C63  0.33µF  [SR20]
C64  0.1 uF  [SR20]
C65  1000 pF  [SR20]
C66  0.33µF  [SR20]
C67  0.1 uF  [SR20]
C68  1000 pF  [SR20]
C69  0.33µF  [SR20]
C86  0.1 uF  [SR20]
C87  0.1 uF  [SR20]
CR2  1N4148  [DO35]
CR3  1N4148  [DO35]
CR4  1N4148  [DO35]
CR5  1N4148  [DO35]
CR6  1N4148  [DO35]
CR7  1N4148  [DO35]
CR8  1N4148  [DO35]
CR9  1N4148  [DO35]
CR10  1N4148  [DO35]
CR11  1N4148  [DO35]
D2  5V1  [DO35]
D3  5V1  [DO35]
D4  5V1  [DO35]
D5  5V1  [DO35]
D6  5V1  [DO35]
D7  5V1  [DO35]
D8  5V1  [DO35]
D9  5V1  [DO35]
D10  5V1  [DO35]
D11  5V1  [DO35]
D12  5V1  [DO35]
J1  5103310-7  [*TYCO_5103310-7]
R58  10k 1%  [RES AXIAL 1/6W]
R59  2.67k 1%  [YAG_MF25]
R65  1.3k 1W  [YAG_FMP100]
R66  4.7k  [RES AXIAL 1/6W]
R67  10k 1%  [RES AXIAL 1/6W]
R68  2.67k 1%  [YAG_MF25]
R69  1.3k 1W  [YAG_FMP100]
R70  4.7k  [RES AXIAL 1/6W]
R71  10k 1%  [RES AXIAL 1/6W]
R72  2.67k 1%  [YAG_MF25]
R73  1.3k 1W  [YAG_FMP100]
R74  4.7k  [RES AXIAL 1/6W]
R75  1.3k 1W  [YAG_FMP100]
R76  4.7k  [RES AXIAL 1/6W]
R77  1.3k 1W  [YAG_FMP100]
R78  4.7k  [RES AXIAL 1/6W]
R79  1.3k 1W  [YAG_FMP100]
R80  4.7k  [RES AXIAL 1/6W]
R84  1.3k 1W  [YAG_FMP100]
R85  4.7k  [RES AXIAL 1/6W]
R88  1.3k 1W  [YAG_FMP100]
R89  4.7k  [RES AXIAL 1/6W]
R93  1.3k 1W  [YAG_FMP100]
R95  4.7k  [RES AXIAL 1/6W]
R97  1.3k 1W  [YAG_FMP100]
R98  4.7k  [RES AXIAL 1/6W]
R99  1.3k 1W  [YAG_FMP100]
R100  4.7k  [RES AXIAL 1/6W]
R102  0 OHM  [RES AXIAL 1/6W]
R103  150k  [RES AXIAL 1/6W]
R104  5.6k  [RES AXIAL 1/6W]
R105  18 k  [RES AXIAL 1/6W]
R106  0 OHM  [RES AXIAL 1/6W]
R107  1.6 M  [RES AXIAL 1/6W]
R108  1k  [RES AXIAL 1/6W]
R109  0 OHM  [RES AXIAL 1/6W]
R110  0 OHM  [RES AXIAL 1/6W]
R111  150k  [RES AXIAL 1/6W]
R112  5.6k  [RES AXIAL 1/6W]
R113  18 k  [RES AXIAL 1/6W]
R114  0 OHM  [RES AXIAL 1/6W]
R115  1.6 M  [RES AXIAL 1/6W]
R116  1k  [RES AXIAL 1/6W]
R117  0 OHM  [RES AXIAL 1/6W]
R118  0 OHM  [RES AXIAL 1/6W]
R119  150k  [RES AXIAL 1/6W]
R120  5.6k  [RES AXIAL 1/6W]
R121  18 k  [RES AXIAL 1/6W]
R122  0 OHM  [RES AXIAL 1/6W]
R123  1.6 M  [RES AXIAL 1/6W]
R124  1k  [RES AXIAL 1/6W]
R125  0 OHM  [RES AXIAL 1/6W]
R126  0 OHM  [RES AXIAL 1/6W]
R127  150k  [RES AXIAL 1/6W]
R128  5.6k  [RES AXIAL 1/6W]
R129  18 k  [RES AXIAL 1/6W]
R130  0 OHM  [RES AXIAL 1/6W]
R131  1.6 M  [RES AXIAL 1/6W]
R132  1k  [RES AXIAL 1/6W]
R133  0 OHM  [RES AXIAL 1/6W]
R141  10k 1%  [RES AXIAL 1/6W]
R142  2.67k 1%  [YAG_MF25]
R143  10k 1%  [RES AXIAL 1/6W]
R144  2.67k 1%  [YAG_MF25]
U30  LM1815N/NOPB  [PDIP14_300MC]
U31  LM1815N/NOPB  [PDIP14_300MC]
U32  LM1815N/NOPB  [PDIP14_300MC]
U33  LM1815N/NOPB  [PDIP14_300MC]

### Nets
+5V: C60.2 C61.2 C64.2 C67.2 CR2.C CR4.C CR6.C CR8.C CR10.C R102.2 R103.1 R104.1 R110.2 R111.1 R112.1 R118.2 R119.1 R120.1 R126.2 R127.1 R128.1 U30.8(VCC) U31.8(VCC) U32.8(VCC) U33.8(VCC)
+Vsens: C50.2 J1.5 J1.6 R65.1 R69.1 R73.1 R75.1 R77.1 R79.1 R84.1 R88.1 R93.1 R97.1 R99.1
GND: C39.1 C42.1 C43.1 C44.1 C47.1 C48.1 C49.1 C50.1 C51.1 C52.1 C53.1 C54.1 C55.1 C56.1 C57.1 C58.1 C59.1 C60.1 C61.1 C62.1 C63.1 C64.1 C65.1 C66.1 C67.1 C68.1 C69.1 C86.1 C87.1 CR3.A CR5.A CR7.A CR9.A CR11.A D2.A D3.A D4.A D5.A D6.A D7.A D8.A D9.A D10.A D11.A D12.A J1.2 J1.4 J1.7 J1.9 J1.11 J1.13 J1.15 J1.17 J1.19 J1.21 J1.23 R59.1 R68.1 R72.1 R106.1 R107.2 R108.1 R109.1 R114.1 R115.2 R116.1 R117.1 R122.1 R123.2 R124.1 R125.1 R130.1 R131.2 R132.1 R133.1 R142.1 R144.1 U30.1(NC) U30.2(GND) U30.4(NC) U30.6(NC) U30.9(TIN) U30.11(SEL) U30.13(NC) U31.1(NC) U31.2(GND) U31.4(NC) U31.6(NC) U31.9(TIN) U31.11(SEL) U31.13(NC) U32.1(NC) U32.2(GND) U32.4(NC) U32.6(NC) U32.9(TIN) U32.11(SEL) U32.13(NC) U33.1(NC) U33.2(GND) U33.4(NC) U33.6(NC) U33.9(TIN) U33.11(SEL) U33.13(NC)
ADC_CH1: J1.14 R67.1
ADC_CH2: J1.12 R71.1
ADC_CH6: J1.10 R143.1
ADC_CH7: J1.8 R141.1
HALL1: J1.22 R105.2
HALL2: J1.20 R113.2
HALL3: J1.18 R121.2
HALL4: J1.16 R129.2
INT0: R104.2 U30.12(REFOUT) ; off-sheet INT0
INT1: R112.2 U31.12(REFOUT) ; off-sheet INT1
INT2: R120.2 U32.12(REFOUT) ; off-sheet INT2
INT3: R128.2 U33.12(REFOUT) ; off-sheet INT3
MCP_PA: J1.3 ; off-sheet MCP_PA
MCP_PB: J1.1 ; off-sheet MCP_PB
PA.PA0: C42.2 D2.C R66.1
PA.PA1: C47.2 D3.C R70.1
PA.PA2: C48.2 D4.C R74.1
PA.PA3: C49.2 D5.C R76.1
PA.PA4: C51.2 D6.C R78.1
PA.PA5: C52.2 D7.C R80.1
PA.PA6: C53.2 D8.C R85.1
PA.PA7: C54.2 D9.C R89.1
PF.PF0: C43.2 CR2.A CR3.C R67.2 R68.2
PF.PF1: C44.2 CR4.A CR5.C R71.2 R72.2
PF.PF2: C55.2 D10.C R95.1
PF.PF3: C56.2 D11.C R98.1
PF.PF4: C57.2 D12.C R100.1
PF.PF5: C39.2 CR6.A CR7.C R58.2 R59.2
PF.PF6: C87.2 CR10.A CR11.C R143.2 R144.2
PF.PF7: C86.2 CR8.A CR9.C R141.2 R142.2
POW: R58.1 ; off-sheet POW
SENS1: J1.34 R65.2 R66.2
SENS2: J1.33 R69.2 R70.2
SENS3: J1.32 R73.2 R74.2
SENS4: J1.31 R75.2 R76.2
SENS5: J1.30 R77.2 R78.2
SENS6: J1.29 R79.2 R80.2
SENS7: J1.28 R84.2 R85.2
SENS8: J1.27 R88.2 R89.2
SENS9: J1.26 R93.2 R95.2
SENS10: J1.25 R97.2 R98.2
SENS11: J1.24 R99.2 R100.2
NetC58_2: C58.2 R103.2 R109.2 U30.14(RCT)
NetC59_2: C59.2 R107.1 U30.7(PDC)
NetC62_2: C62.2 R111.2 R117.2 U31.14(RCT)
NetC63_2: C63.2 R115.1 U31.7(PDC)
NetC65_2: C65.2 R119.2 R125.2 U32.14(RCT)
NetC66_2: C66.2 R123.1 U32.7(PDC)
NetC68_2: C68.2 R127.2 R133.2 U33.14(RCT)
NetC69_2: C69.2 R131.1 U33.7(PDC)
NetR102_1: R102.1 R106.2 U30.5(MODE)
NetR105_1: R105.1 U30.3(VIN)
NetR108_2: R108.2 U30.10(GOUT)
NetR110_1: R110.1 R114.2 U31.5(MODE)
NetR113_1: R113.1 U31.3(VIN)
NetR116_2: R116.2 U31.10(GOUT)
NetR118_1: R118.1 R122.2 U32.5(MODE)
NetR121_1: R121.1 U32.3(VIN)
NetR124_2: R124.2 U32.10(GOUT)
NetR126_1: R126.1 R130.2 U33.5(MODE)
NetR129_1: R129.1 U33.3(VIN)
NetR132_2: R132.2 U33.10(GOUT)

### Buses and harness runs
bus PA[0..7]
bus PF[0..7]
bus SENS[1..11]

### Notes on the sheet
- (near R102) R102,R106 - MODE SELECT !!!
- Left turn
- Right turn
- Brake
- Horn
- (near J1) Left weight sens
- (near J1) Right weight sens
- Door - 1
- R109 - RCT SELECT
- Door - 2
- Door - 3
- Door - 4
- Steering wheel
- GND
- Hal sensor-1
- GND-HALL1
- Hal sensor-2
- GND-HALL2
- Hal sensor-3
- GND-HALL3
- Hal sensor-4
- GND-HALL4
- ADC CHANNEL 1
- GND-ADC CH1
- GND-ADC CH2
- ADC CHANNEL 2
- GND-ADC CH6
- ADC CHANNEL 6
- ADC CHANNEL 7
- GND POW-SENS
- +12V POW-SENS
- GND-ADC CH7
- DVR PORT A
- GND DVR
- DVR PORT B
- (in symbol TitleBlock0) Title; Size; Document Number; Rev; Date:; Sheet; of

### Library data of the parts
C39 C42-C44 C47-C57 C60 C61 C64 C67 C86 C87 = CAP RADIAL 2.54: as C78 on sheet DRIVERS; RefDes: RefDes; Value: 0.1 uF
C58 C62 C65 C68 = CAP RADIAL 2.54: as C79 on sheet DRIVERS; RefDes: RefDes; Value: 1000 pF
C59 C63 C66 C69 = CAP RADIAL 2.54: CAP CER 0.33UF 50V X8R RADIAL; Manufacturer_Part_Number: AR205F334K4R; Vendor: AVX Corporation; Type: DEV; RefDes: RefDes; Value: 0.33µF
CR2-CR11 = 1N4148: Imported; Vendor: Nexperia; Type: DEV; C: Copyright (C) 2015 Accelerated Designs. All rights reserved; Manufacturer_Part_Number: 1N4148; Copyright: Copyright (C) 2016 Accelerated Designs. All rights reserved; RefDes: RefDes; Value: Value
D2-D12 = ZENNER DO-35: DIODE ZENER 5.1V 500MW DO35; Manufacturer_Part_Number: 1N5231B; Vendor: ON Semiconductor; Value: 5V1
J1 = 5103310-7: A/L LOW PRO HDR 34P RA BLACK
R58 R67 R71 R141 R143 = Resistor Axial  1/6W: RES 10K OHM 1/8W 1% AXIAL; Manufacturer_Part_Number: RNF18FTD10K0; Vendor: Stackpole Electronics Inc.; RefDes: RefDes; Type: DEV; Value: 10k 1%
R59 R68 R72 R142 R144 = Resistor Axial  1/4W: RES 2.67K OHM 1/4W 1% AXIAL; Manufacturer_Part_Number: MFR-25FBF52-2K67; Vendor: *; RefDes: RefDes; Type: DEV; Value: 2.67k 1%
R65 R69 R73 R75 R77 R79 R84 R88 R93 R97 R99 = Resistor Axial  1W: RES 1.3K OHM 1W 5% AXIAL; Manufacturer_Part_Number: RSF100JB-73-1K3; Vendor: Yageo; RefDes: RefDes; Type: DEV; Value: 1.3k 1W
R66 R70 R74 R76 R78 R80 R85 R89 R95 R98 R100 = Resistor Axial  1/6W: RES 4.7K OHM 1/6W 5% AXIAL; Manufacturer_Part_Number: CFR-12JB-52-4K7; Vendor: Yageo; RefDes: RefDes; Type: DEV; Value: 4.7k
R102 R106 R109 R110 R114 R117 R118 R122 R125 R126 R130 R133 = Resistor Axial  1/6W: as R61 on sheet MAIN; RefDes: RefDes; Type: DEV; Value: 0 OHM
R103 R111 R119 R127 = Resistor Axial  1/6W: RES 150K OHM 1/6W 5% AXIAL; Manufacturer_Part_Number: CFR-12JB-52-150K; Vendor: Yageo; RefDes: RefDes; Type: DEV; Value: 150k
R104 R112 R120 R128 = Resistor Axial  1/6W: RES 5.6K OHM 1/6W 5% AXIAL; Manufacturer_Part_Number: CFR-12JB-52-5K6; Vendor: Yageo; RefDes: RefDes; Type: DEV; Value: 5.6k
R105 R113 R121 R129 = Resistor Axial  1/6W: RES 18K OHM 1/6W 5% AXIAL; Manufacturer_Part_Number: CFR-12JB-52-18K; Vendor: Yageo; RefDes: RefDes; Type: DEV; Value: 18 k
R107 R115 R123 R131 = Resistor Axial  1/6W: RES 1.6M OHM 1/6W 5% AXIAL; Manufacturer_Part_Number: CFR-12JB-52-1M6; Vendor: Yageo; RefDes: RefDes; Type: DEV; Value: 1.6 M
R108 R116 R124 R132 = Resistor Axial  1/6W: as R1 on sheet DRIVERS; RefDes: RefDes; Type: DEV; Value: 1k
U30-U33 = LM1815N/NOPB: IC AMP ADAPTIVE SENSOR 14-DIP; Built_By: EMA_UL_Team; C: Copyright (C) 2015 Accelerated Designs. All rights reserved; Manufacturer_Part_Number: LM1815N/NOPB; RefDes: RefDes; Type: DEV; Value: LM1815N/NOPB
*#4 = TitleBlock0: Page Number: 5; Page Create Date: March  8, 1995

## Nets that join several sheets
+5V: LIGHT (C15.1 U18.14), MAIN (13 pins), POWER (R63.1), SENSORS (25 pins)
GND: DRIVERS (68 pins), LIGHT (40 pins), MAIN (16 pins), POWER (10 pins), SENSORS (105 pins)
DR5: DRIVERS (R33.2), MAIN (U26.8)
DR6: DRIVERS (R39.2), MAIN (U26.9)
INT0: MAIN (U26.25), SENSORS (R104.2 U30.12)
INT1: MAIN (U26.26), SENSORS (R112.2 U31.12)
INT2: MAIN (U26.27), SENSORS (R120.2 U32.12)
INT3: MAIN (U26.28), SENSORS (R128.2 U33.12)
LT: LIGHT (U18.1), MAIN (U26.14)
MCP_PA: MAIN (U27.5 U27.6), SENSORS (J1.3)
MCP_PB: MAIN (U27.7), SENSORS (J1.1)
PA.PA0: MAIN (U26.51), SENSORS (C42.2 D2.C R66.1)
PA.PA1: MAIN (U26.50), SENSORS (C47.2 D3.C R70.1)
PA.PA2: MAIN (U26.49), SENSORS (C48.2 D4.C R74.1)
PA.PA3: MAIN (U26.48), SENSORS (C49.2 D5.C R76.1)
PA.PA4: MAIN (U26.47), SENSORS (C51.2 D6.C R78.1)
PA.PA5: MAIN (U26.46), SENSORS (C52.2 D7.C R80.1)
PA.PA6: MAIN (U26.45), SENSORS (C53.2 D8.C R85.1)
PA.PA7: MAIN (U26.44), SENSORS (C54.2 D9.C R89.1)
PC.PC0: DRIVERS (R3.2), MAIN (U26.35)
PC.PC1: DRIVERS (R9.2), MAIN (U26.36)
PC.PC2: DRIVERS (R15.2), MAIN (U26.37)
PC.PC3: DRIVERS (R4.2), MAIN (U26.38)
PC.PC4: DRIVERS (R10.2), MAIN (U26.39)
PC.PC5: DRIVERS (R16.2), MAIN (U26.40)
PC.PC6: DRIVERS (R20.2), MAIN (U26.41)
PC.PC7: DRIVERS (R27.2), MAIN (U26.42)
PD4: DRIVERS (R21.1 R25.1), MAIN (U26.29)
PF.PF0: MAIN (U26.61), SENSORS (5 pins)
PF.PF1: MAIN (U26.60), SENSORS (5 pins)
PF.PF2: MAIN (U26.59), SENSORS (C55.2 D10.C R95.1)
PF.PF3: MAIN (U26.58), SENSORS (C56.2 D11.C R98.1)
PF.PF4: MAIN (U26.57), SENSORS (C57.2 D12.C R100.1)
PF.PF5: MAIN (U26.56), SENSORS (5 pins)
PF.PF6: MAIN (U26.55), SENSORS (5 pins)
PF.PF7: MAIN (U26.54), SENSORS (5 pins)
PG0: DRIVERS (R23.1), MAIN (U26.33)
PG1: DRIVERS (R28.1), MAIN (U26.34)
PG2: DRIVERS (R36.1), MAIN (U26.43)
PG3: DRIVERS (R42.1), MAIN (U26.18)
PG4: DRIVERS (R34.1 R40.1), MAIN (U26.19)
POW: POWER (C40.2 C46.1 U28.3 U29.1), SENSORS (R58.1)
PWM1: LIGHT (R49.2), MAIN (U26.15)
PWM2: LIGHT (R134.2), MAIN (U26.16)
PWM3: LIGHT (U18.2 U18.5 U18.10 U18.13), MAIN (U26.17)
PWM4: LIGHT (R96.2), MAIN (U26.5)
PWM5: LIGHT (R91.2), MAIN (U26.6)
PWM6: LIGHT (R81.2), MAIN (U26.7)
RB: LIGHT (U18.12), MAIN (U26.32)
RD: LIGHT (U18.9), MAIN (U26.31)
RT: LIGHT (U18.4), MAIN (U26.30)